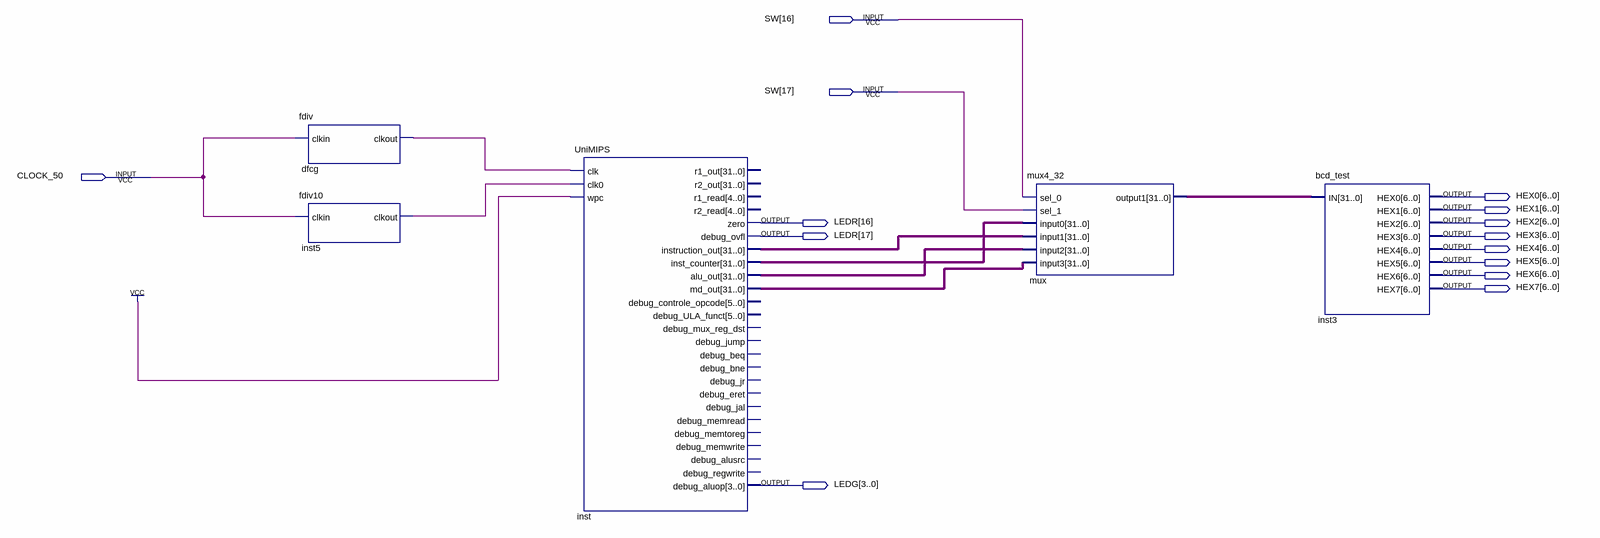
[diagram p0: schematic sheet]
// Quartus schematic UniMIPS_block.bdf as structural Verilog: 5 symbols, 14 pins
module UniMIPS_block (
  input  [17:16] SW,
  input  CLOCK_50,
  output [6:0] HEX0,
  output [6:0] HEX1,
  output [17:16] LEDR,
  output [6:0] HEX2,
  output [6:0] HEX3,
  output [6:0] HEX4,
  output [6:0] HEX5,
  output [6:0] HEX6,
  output [6:0] HEX7,
  output [3:0] LEDG
);

  wire dfcg_clkout, inst5_clkout;
  wire [31:0] inst_alu_out, inst_inst_counter, inst_instruction_out, inst_md_out, mux_output1;

  fdiv dfcg (.clkin(CLOCK_50), .clkout(dfcg_clkout));
  fdiv10 inst5 (.clkin(CLOCK_50), .clkout(inst5_clkout));
  UniMIPS inst (
    .clk(dfcg_clkout), .clk0(inst5_clkout), .wpc(1'b1), .zero(LEDR[16]), .debug_ovfl(LEDR[17]),
    .instruction_out(inst_instruction_out), .inst_counter(inst_inst_counter), .alu_out(inst_alu_out),
    .md_out(inst_md_out), .debug_aluop(LEDG));  // open: r1_out, r2_out, r1_read, r2_read, debug_controle_opcode, debug_ULA_funct, debug_mux_reg_dst, debug_jump, debug_beq, debug_bne, debug_jr, debug_eret, debug_jal, debug_memread, debug_memtoreg, debug_memwrite, debug_alusrc, debug_regwrite
  mux4_32 mux (
    .sel_0(SW[16]), .sel_1(SW[17]), .input0(inst_inst_counter), .input1(inst_instruction_out),
    .input2(inst_alu_out), .input3(inst_md_out), .output1(mux_output1));
  bcd_test inst3 (
    .IN(mux_output1), .HEX0(HEX0), .HEX1(HEX1), .HEX2(HEX2), .HEX3(HEX3), .HEX4(HEX4), .HEX5(HEX5),
    .HEX6(HEX6), .HEX7(HEX7));
endmodule
